# EAGLE design pic32_dip_breakout (EAGLE 7.5.0)
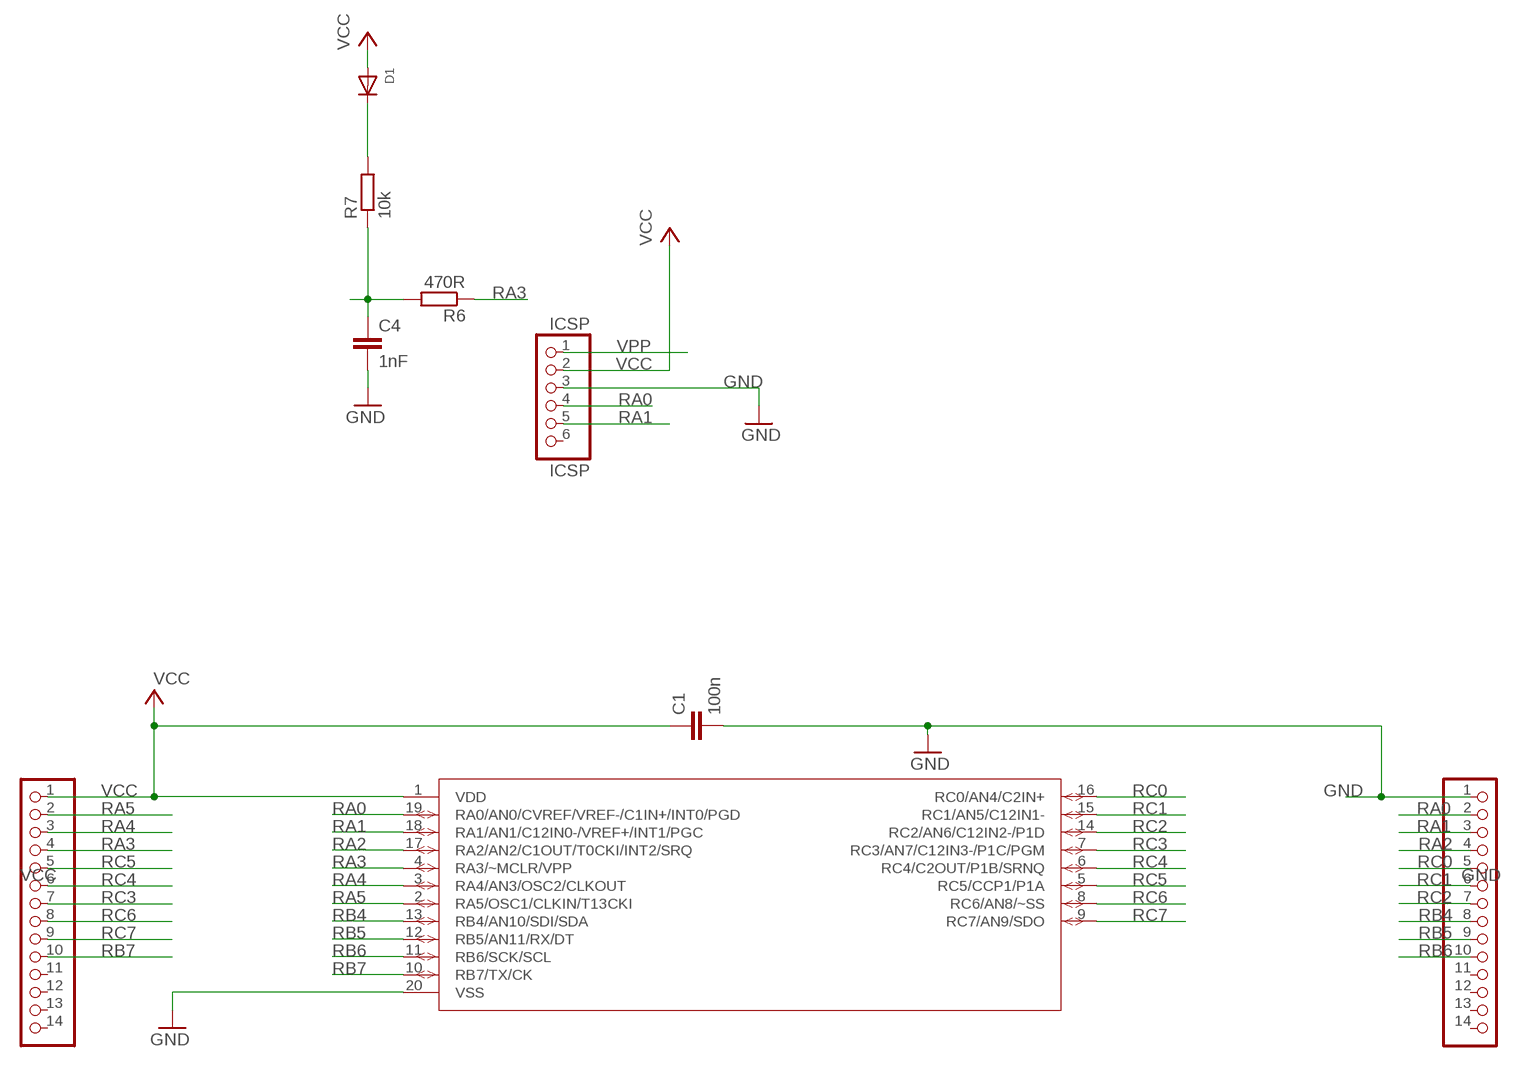
[diagram p0: schematic, sheet 1]

## Parts
C1  100n  C-EUC0805  [C0805]
C4  1nF  C-EUC0805  [C0805]
D1  DIODESOD-323F  [SOD-323F]
GND  PINHD-1X14  [1X14]
ICSP  ICSP  PINHD-1X6  [1X06]
R6  470R  R-EU_R0805  [R0805]
R7  10k  R-EU_R0805  [R0805]
U$1  PIC18F14K22-I/P  [DIP254P762X533-20]
VCC  PINHD-1X14  [1X14]

## Nets
GND [GND]: C1.2 C4.2 GND.1 ICSP.3 U$1.20(VSS)
N$7: D1.C R7.2
RA0: GND.2 ICSP.4 U$1.19(RA0/AN0/CVREF/VREF-/C1IN+/INT0/PGD)
RA1: GND.3 ICSP.5 U$1.18(RA1/AN1/C12IN0-/VREF+/INT1/PGC)
RA2: GND.4 U$1.17(RA2/AN2/C1OUT/T0CKI/INT2/SRQ)
RA3: R6.1 U$1.4(RA3/~MCLR/VPP) VCC.4
RA4: U$1.3(RA4/AN3/OSC2/CLKOUT) VCC.3
RA5: U$1.2(RA5/OSC1/CLKIN/T13CKI) VCC.2
RB4: GND.8 U$1.13(RB4/AN10/SDI/SDA)
RB5: GND.9 U$1.12(RB5/AN11/RX/DT)
RB6: GND.10 U$1.11(RB6/SCK/SCL)
RB7: U$1.10(RB7/TX/CK) VCC.10
RC0: GND.5 U$1.16(RC0/AN4/C2IN+)
RC1: GND.6 U$1.15(RC1/AN5/C12IN1-)
RC2: GND.7 U$1.14(RC2/AN6/C12IN2-/P1D)
RC3: U$1.7(RC3/AN7/C12IN3-/P1C/PGM) VCC.7
RC4: U$1.6(RC4/C2OUT/P1B/SRNQ) VCC.6
RC5: U$1.5(RC5/CCP1/P1A) VCC.5
RC6: U$1.8(RC6/AN8/~SS) VCC.8
RC7: U$1.9(RC7/AN9/SDO) VCC.9
VCC [VCC]: C1.1 D1.A ICSP.2 U$1.1(VDD) VCC.1
VPP: C4.1 ICSP.1 R6.2 R7.1
Unconnected: GND.11 GND.12 GND.13 GND.14 ICSP.6 VCC.11 VCC.12 VCC.13 VCC.14

## Library data of the parts
C1 = rcl:C-EU: CAPACITOR, European symbol
C4 = resistor:C-EU: CAPACITOR, European symbol
D1 = adafruit:DIODE: Diode SMADIODE - SMA Surface Mount Package 20V 1A Schottky Diode Digikey: 641-1014-6-ND DO-1N4148 - Through Hole Small Current Diode SOD-123 20V 1 A (.5mV Vf) Schottky Diode - Digikey: MBRX120TPMSCT-ND SOD-323 10V 570mA (.38mV Vf, 3ns) Schottky Diode - Digikey: ZLLS410CT-ND SOD-523 30V 30mA Schottky Diode (RB751S-40TE61) - Digikey: RB751S-40TE61CT-ND SOT23-R/W - SOT23 Package (R = Solder Paste/Reflow Ovens, W = Hand-Soldering) BAT54Film 40V 300mA - Digikey: 497-7162-1-ND
GND VCC = pinhead:PINHD-1X14: PIN HEADER
ICSP = pinhead:PINHD-1X6: PIN HEADER
R6 R7 = resistor:R-EU_: RESISTOR, European symbol
U$1 = thierry_eagle:PIC18F14K22-I/P: Flash Microcontrollers; DESCRIPTION: Flash Microcontrollers; MPN: PIC18F14k22-I/P; OC_FARNELL: 1778462; OC_NEWARK: 07P9675; PACKAGE: PDIP-20; SUPPLIER: Microchip

## Net classes
0 default: width 0.406 mm, drill 0.508 mm
1 GND: width 0.508 mm, drill 0.508 mm
2 VCC: width 1.016 mm, drill 0.508 mm
4 VCCEXT: width 0.762 mm, drill 0.508 mm, clearance 0.229 mm

## Board
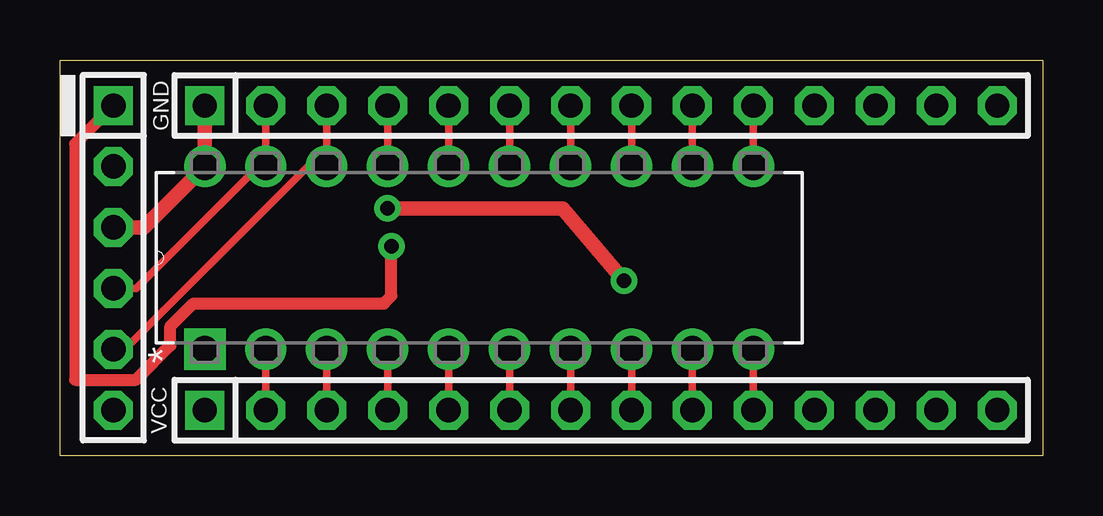
[diagram p1: board, top side]
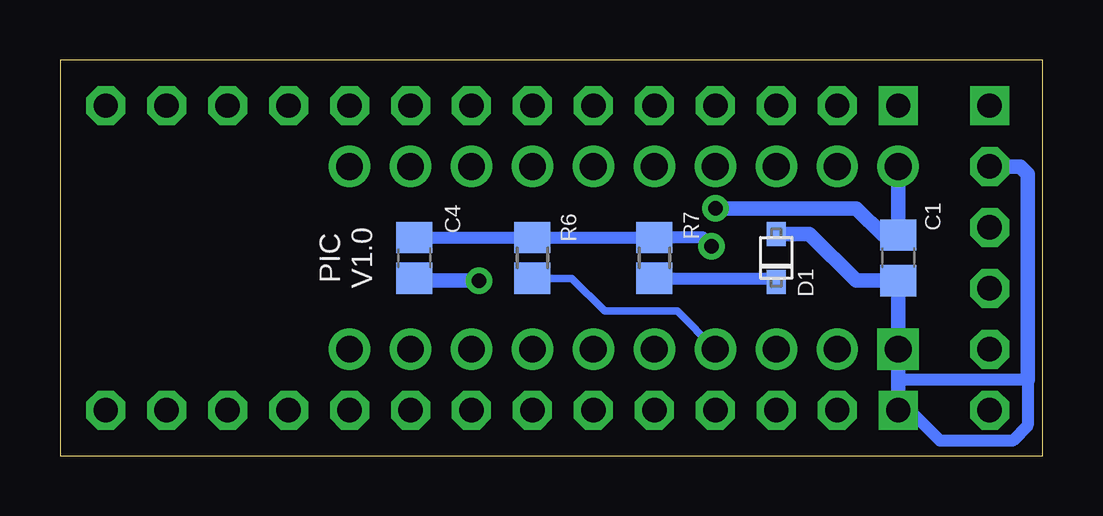
[diagram p2: board, bottom side, seen from below]

Size 40.96 x 16.51 mm. Coordinates in mm from the lower left corner, seen from the top.
Outline: 0,16.51 40.96,16.51 40.96,0 0,0 0,16.51
Copper layers (1*16): Top 0.035mm / dielectric 1.5mm / Bottom 0.035mm
Design rules "SparkFun": minimum track width 8mil, minimum drill 20mil, track to track 8mil, track to pad 8mil, pad to pad 8mil, via to via 8mil, smd to smd 8mil, copper to edge 10mil, drill to drill 8mil, minimum pad ring 12mil, minimum via ring 10mil, stop-mask expansion 4mil, vias tented up to drill 25mil, thermal gap 10mil

### Footprints (pad centres in the part's own frame; a part is rotated, then mirrored left to right if it is on the bottom)
C0805 = smd 1.3 x 1.5: 1 -0.95,0; 2 0.95,0
C0805' = smd 1.3 x 1.5: 1 -0.85,0; 2 0.85,0
SOD-323F = smd 1 x 0.8: A -1,0; C 1,0
1X14 = drill 1.016 square: 1 -16.51,0 | drill 1.016 octagon: 2 -13.97,0; 3 -11.43,0; 4 -8.89,0; 5 -6.35,0; 6 -3.81,0; 7 -1.27,0; 8 1.27,0; 9 3.81,0; 10 6.35,0; 11 8.89,0; 12 11.43,0; 13 13.97,0; 14 16.51,0
1X06 = drill 1.016 square: 1 -6.35,0 | drill 1.016 octagon: 2 -3.81,0; 3 -1.27,0; 4 1.27,0; 5 3.81,0; 6 6.35,0
R0805 = smd 1.3 x 1.5: 1 -0.85,0; 2 0.85,0
DIP254P762X533-20 = drill 1.118 square: 1 -7.62,22.86 | drill 1.118: 2 -7.62,20.32; 3 -7.62,17.78; 4 -7.62,15.24; 5 -7.62,12.7; 6 -7.62,10.16; 7 -7.62,7.62; 8 -7.62,5.08; 9 -7.62,2.54; 10 -7.62,0; 11 0,0; 12 0,2.54; 13 0,5.08; 14 0,7.62; 15 0,10.16; 16 0,12.7; 17 0,15.24; 18 0,17.78; 19 0,20.32; 20 0,22.86

### Placement (x,y rotation side)
C1  6.03,8.26 90 bottom
C4  1nF  [C0805']  26.19,8.26 270 bottom
D1  11.11,8.26 270 bottom
GND  22.54,14.61 0 top
ICSP  2.22,8.26 270 top
R6  21.27,8.26 90 bottom
R7  16.19,8.26 270 bottom
U$1  28.89,12.06 90 top
VCC  22.54,1.91 0 top

### Tracks (layer width: path | path; a pad name or v marks a point on that pad's centre or on a via)
GND  (via drill 0.6)
  Top 0.61: GND.1 U$1.20 3.49,9.52 ICSP.3 | v13.65,10.32 20.96,10.32 v23.5,7.3
  Bottom 0.305: C1.2 6.67,9.2 | 26.09,7.3 C4.2
  Bottom 0.61: U$1.20 C1.2 | 6.67,9.2 7.78,10.32 v13.65,10.32 | v23.5,7.3 26.09,7.3
N$7
  Bottom 0.305: 11.26,7.41 D1.C
  Bottom 0.508: R7.2 11.26,7.41
RA0
  Top 0.305: GND.2 U$1.19 8.25,12.06 3.18,6.98 ICSP.4
RA1
  Top 0.305: GND.3 U$1.18 10.32,12.06 2.7,4.45 ICSP.5
RA2
  Top 0.305: GND.4 U$1.17
RA3
  Top 0.305: VCC.4 U$1.4
  Bottom 0.305: R6.1 19.63,7.41 18.26,6.03 15.24,6.03 U$1.4
RA4
  Top 0.305: VCC.3 U$1.3
RA5
  Top 0.305: VCC.2 U$1.2
RB4
  Top 0.305: GND.8 U$1.13
RB5
  Top 0.305: GND.9 U$1.12
RB6
  Top 0.305: GND.10 U$1.11
RB7
  Top 0.305: U$1.10 VCC.10
RC0
  Top 0.305: GND.5 U$1.16
RC1
  Top 0.305: GND.6 U$1.15
RC2
  Top 0.305: GND.7 U$1.14
RC3
  Top 0.305: VCC.7 U$1.7
RC4
  Top 0.305: VCC.6 U$1.6
RC5
  Top 0.305: VCC.5 U$1.5
RC6
  Top 0.305: VCC.8 U$1.8
RC7
  Top 0.305: VCC.9 U$1.9
VCC
  Bottom 0.305: C1.1
  Bottom 0.508: VCC.1 5.56,1.91 4.29,0.63 1.27,0.63 0.64,1.27 0.64,3.18 6.03,3.18
  Bottom 0.61: VCC.1 6.03,3.18 U$1.1 C1.1 | ICSP.2 0.95,12.06 0.64,11.75 0.64,3.18 | D1.A 9.73,9.26 7.78,7.3 C1.1
VPP  (via drill 0.6)
  Top 0.508: ICSP.1 0.64,13.02 0.64,3.18 3.18,3.18 4.6,4.6 4.6,5.4 5.56,6.35 13.49,6.35 13.81,6.67 v13.81,8.73
  Bottom 0.508: C4.1 R6.2 R7.1 14.18,9.11 v13.81,8.73

### Text on the board
bNames: PIC / V1.0